# EAGLE schematic schematic (EAGLE 8.1.0)
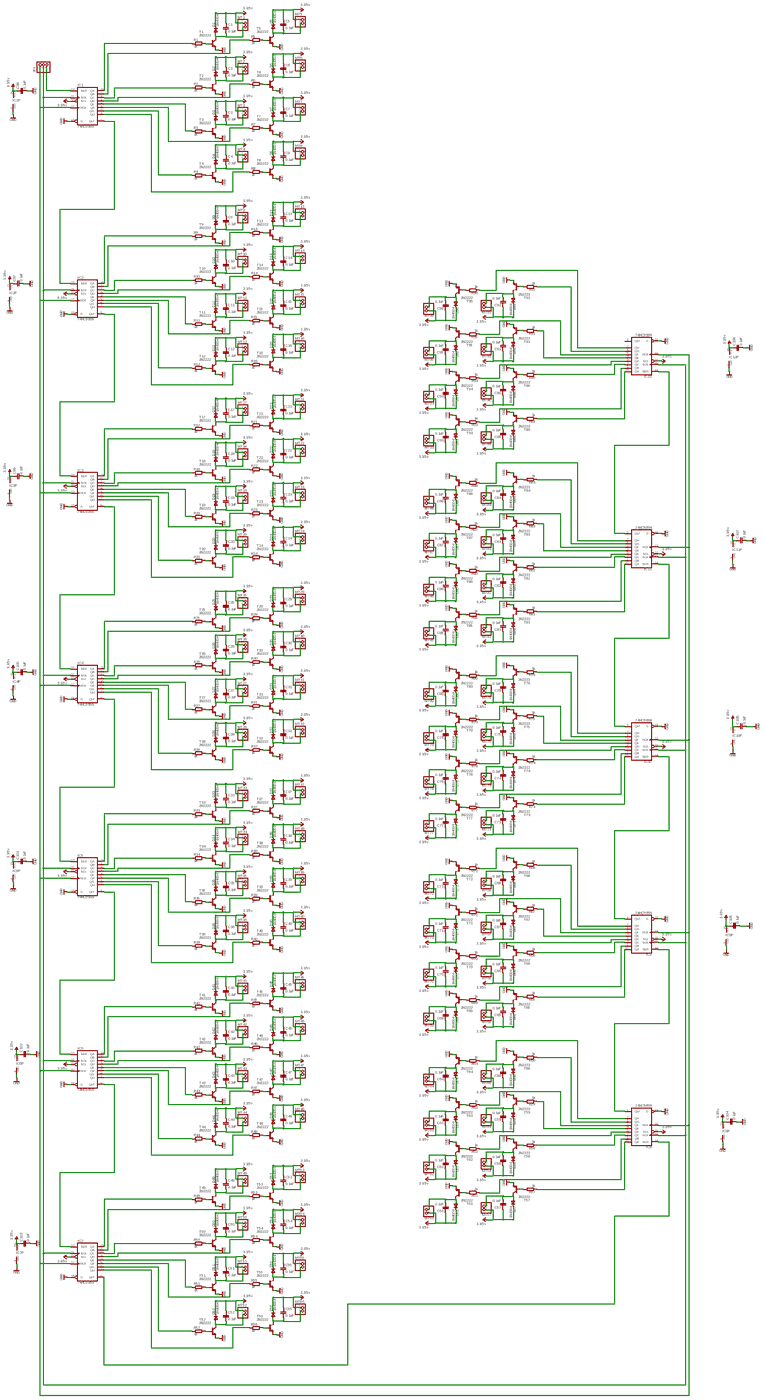
[diagram p0: schematic, sheet 1, overview]
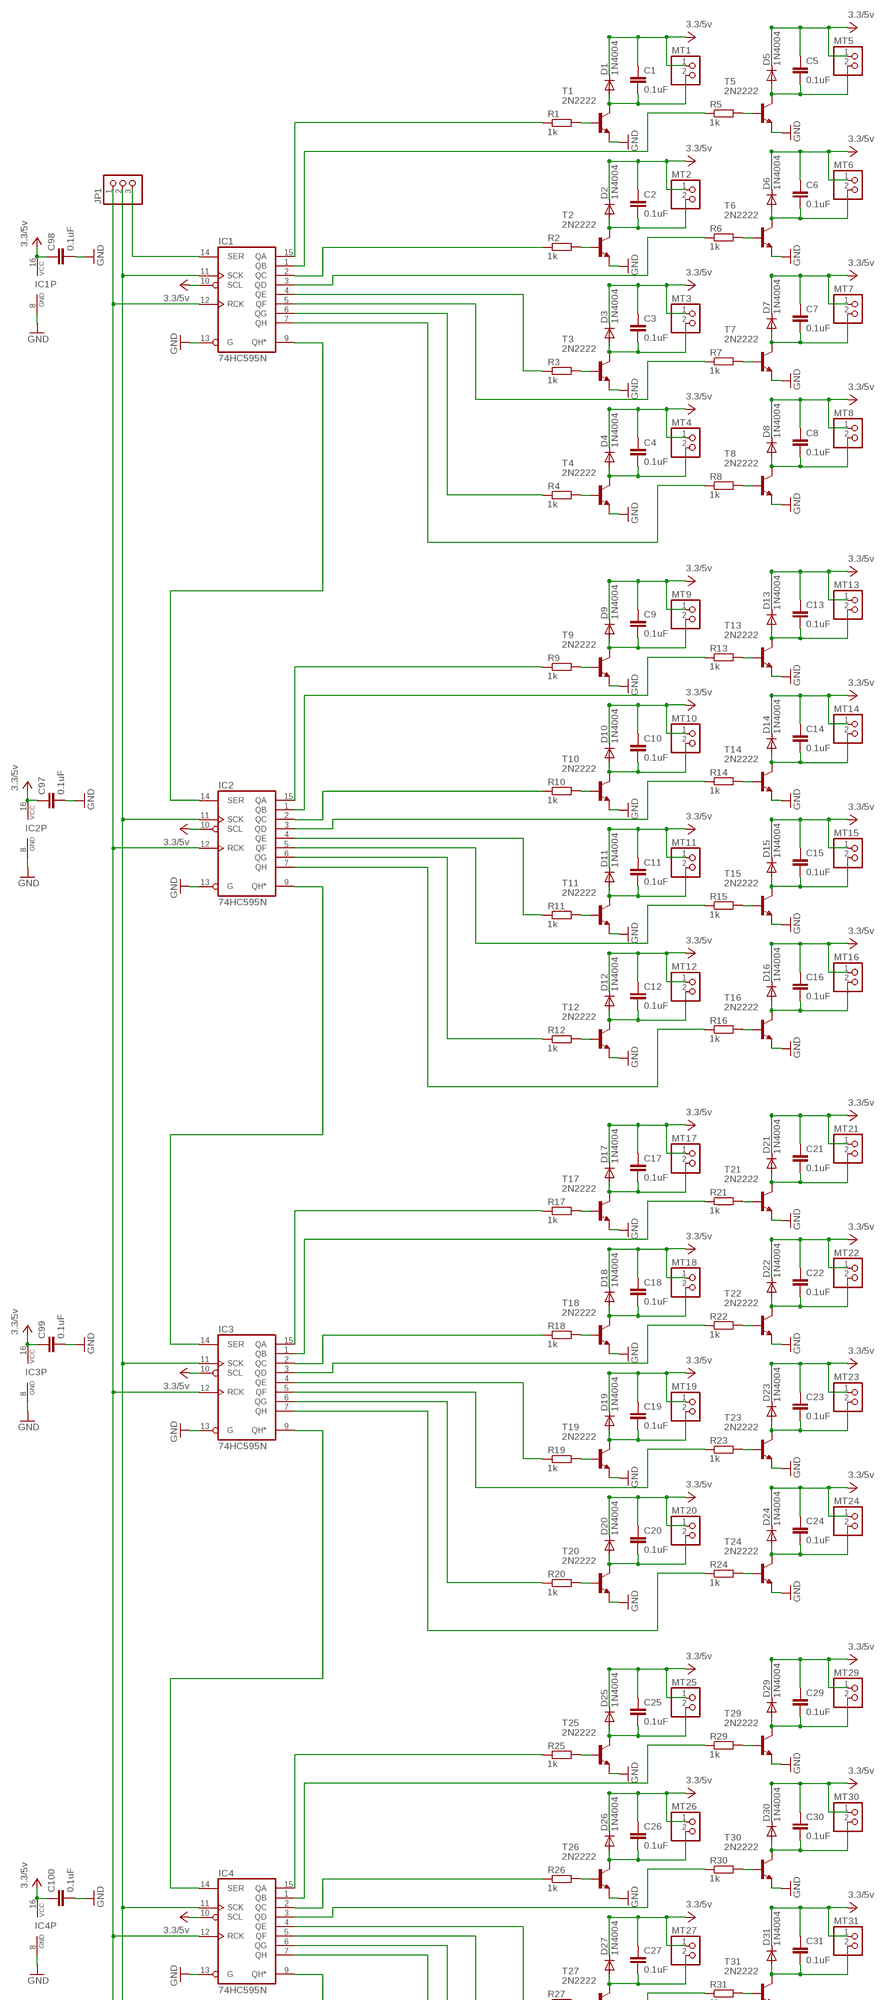
[diagram p1: schematic, sheet 1, part 1 of 4]
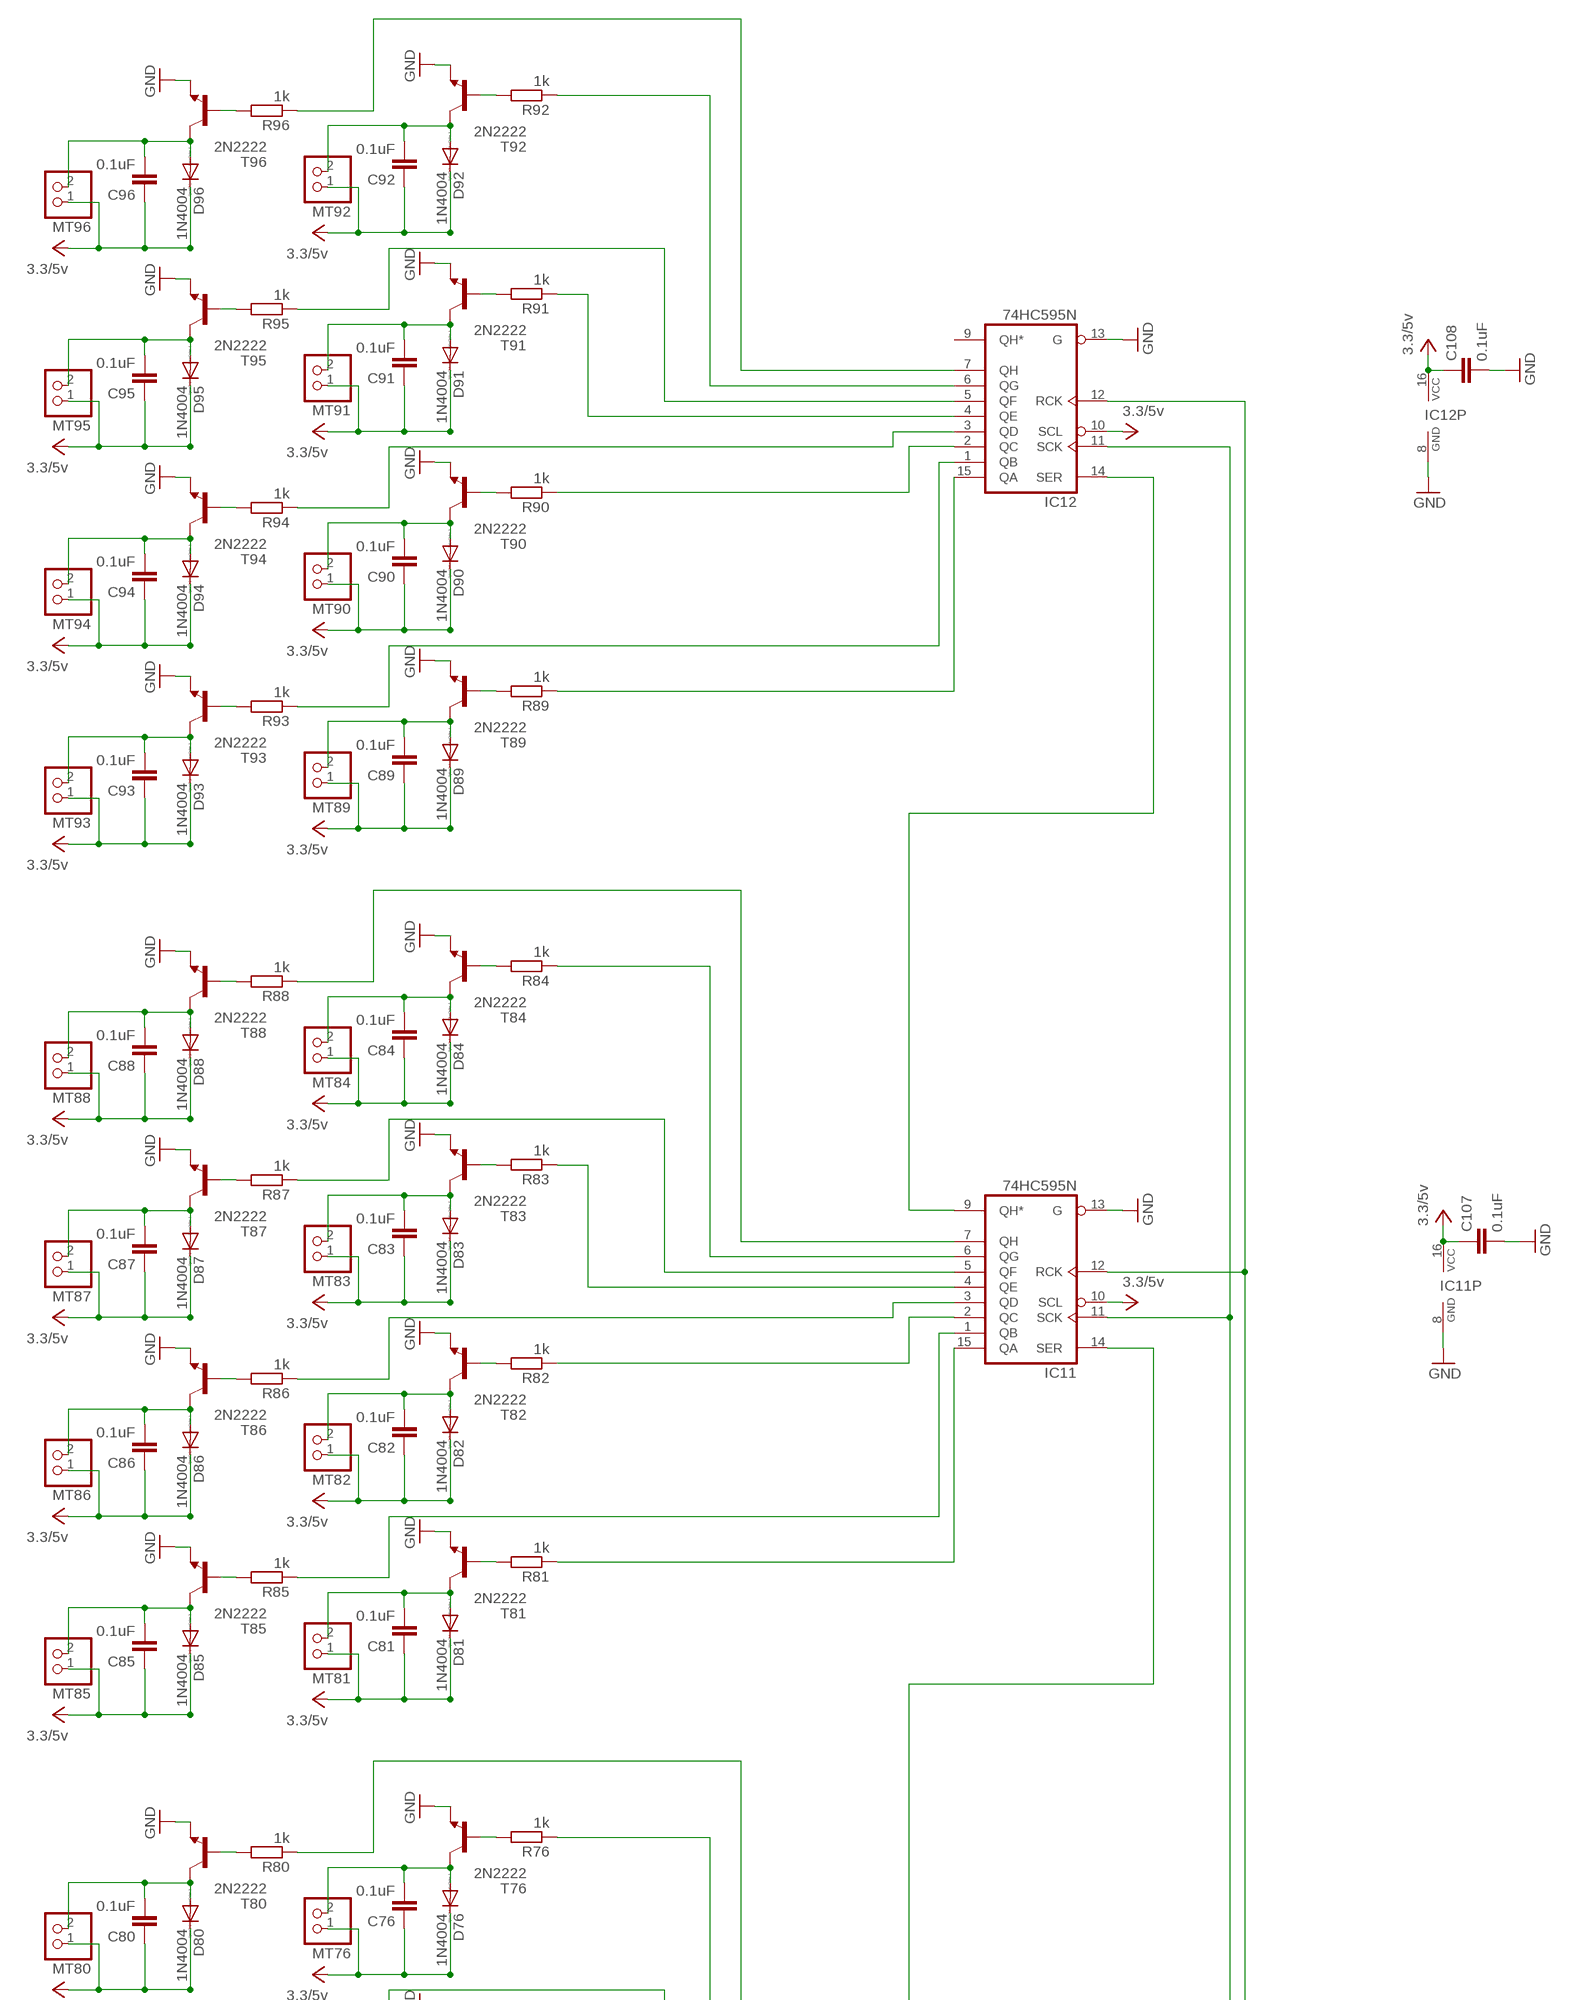
[diagram p2: schematic, sheet 1, part 2 of 4]
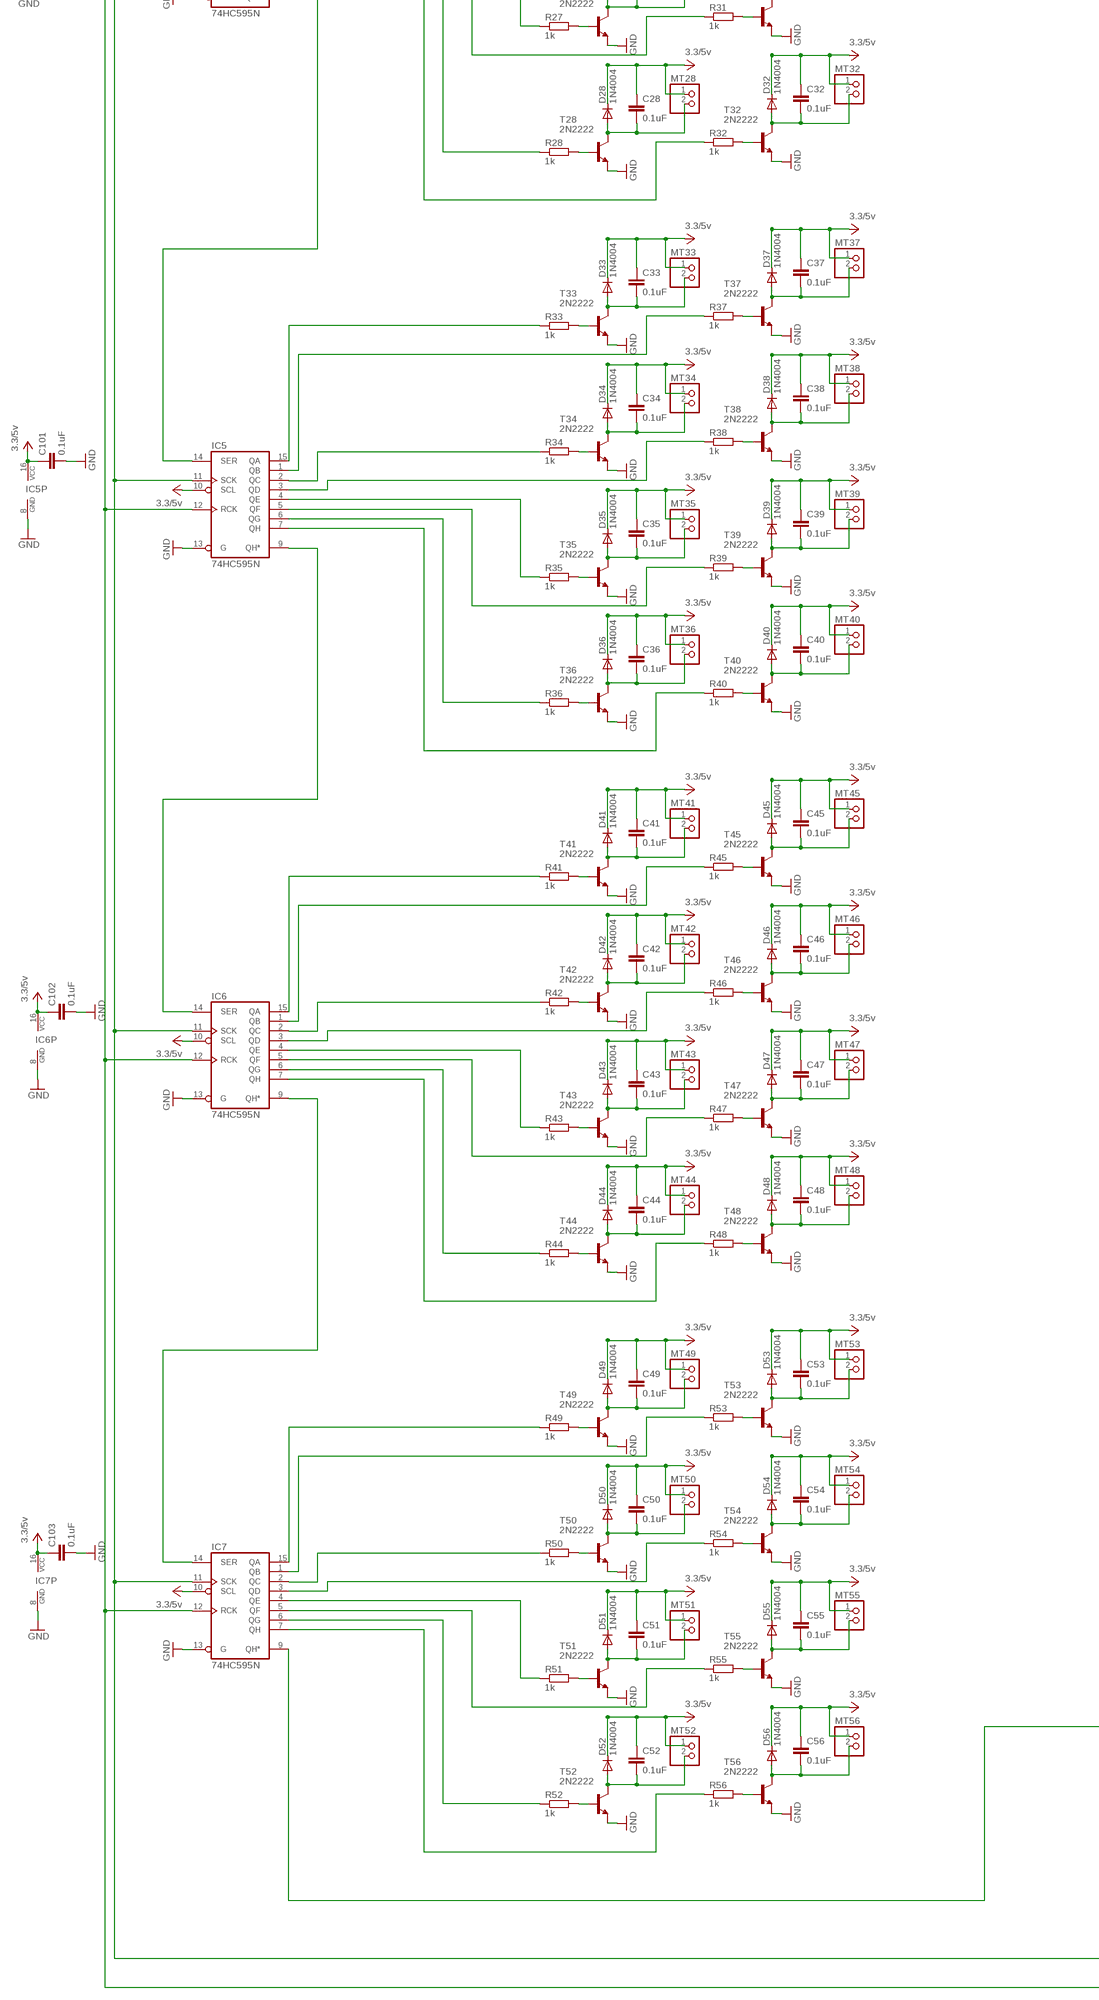
[diagram p3: schematic, sheet 1, part 3 of 4]
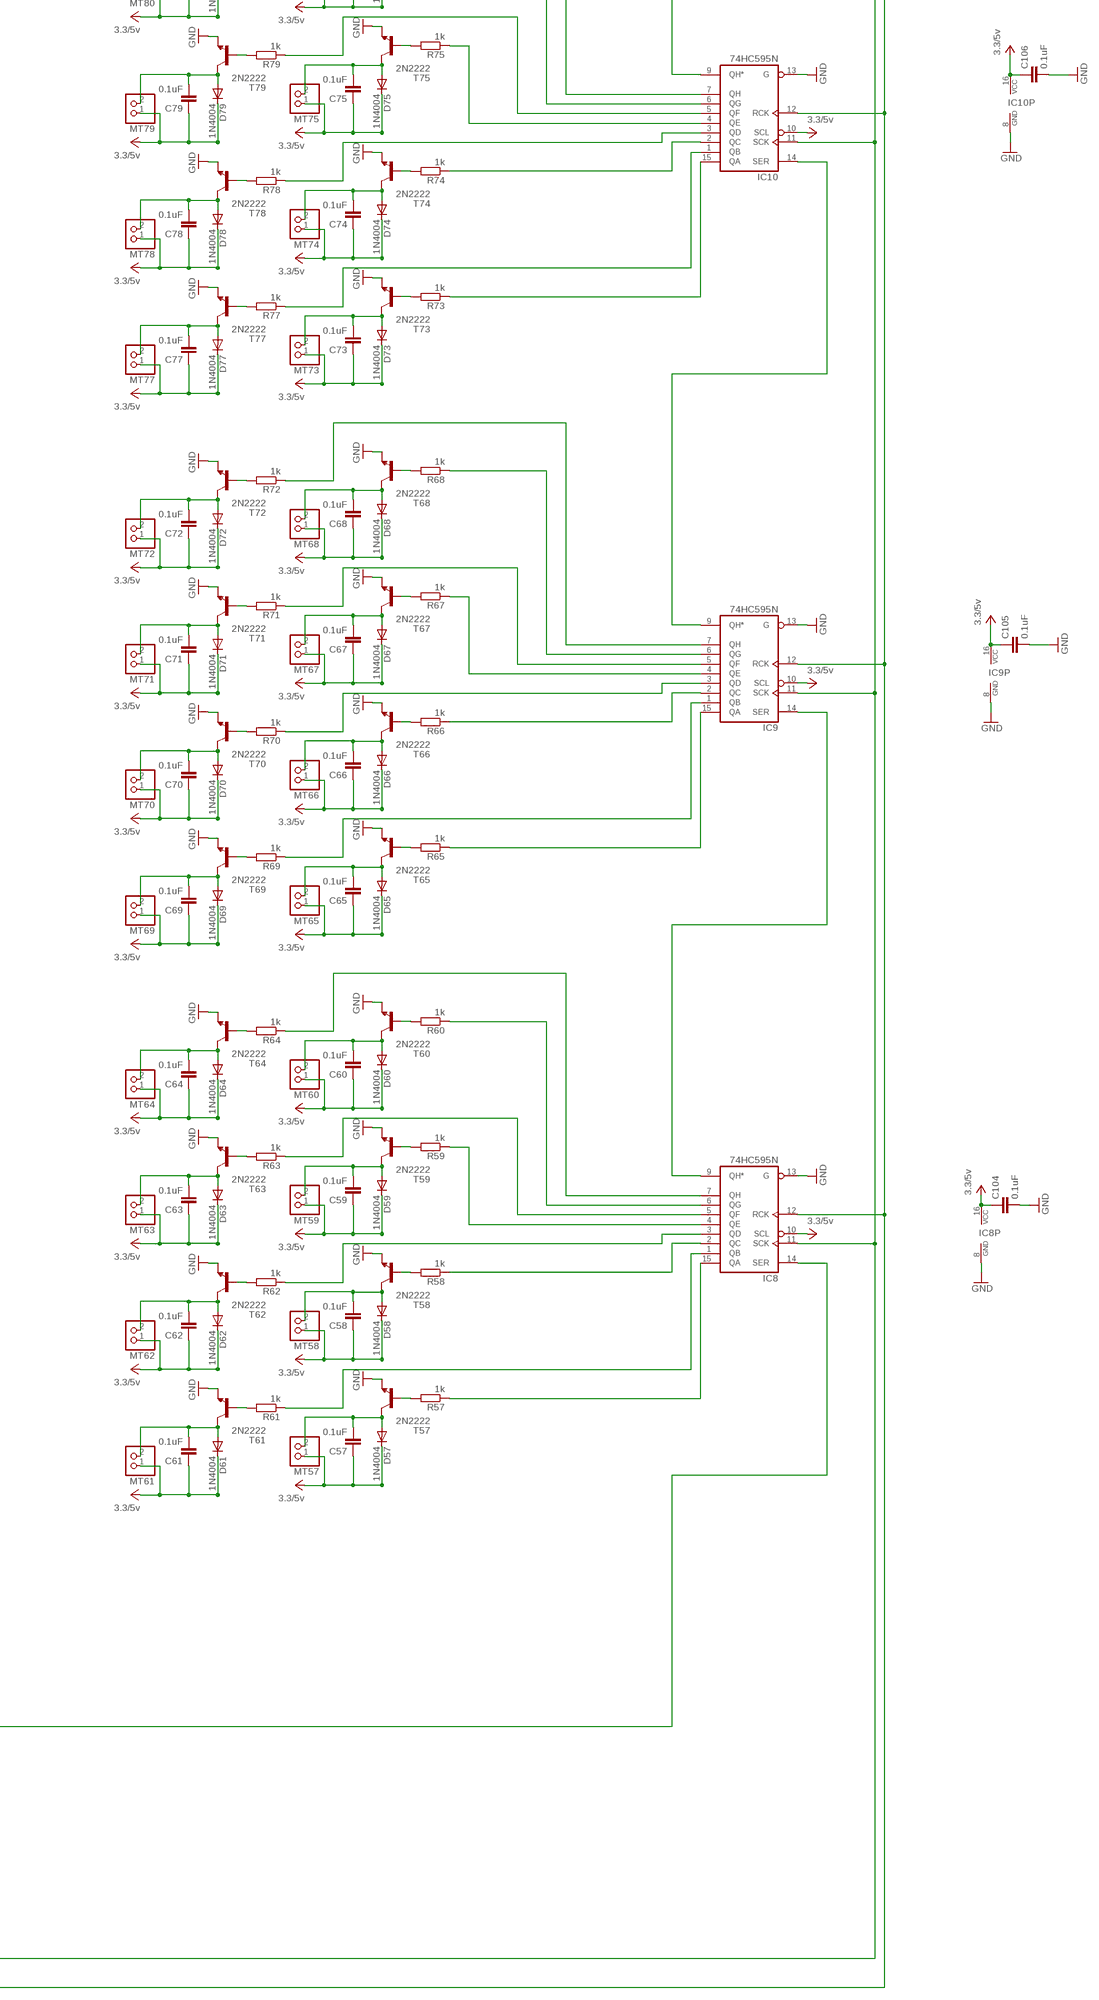
[diagram p4: schematic, sheet 1, part 4 of 4]

## Parts
C1  0.1uF  C-EU025-024X044  [C025-024X044]
C2  0.1uF  C-EU025-024X044  [C025-024X044]
C3  0.1uF  C-EU025-024X044  [C025-024X044]
C4  0.1uF  C-EU025-024X044  [C025-024X044]
C5  0.1uF  C-EU025-024X044  [C025-024X044]
C6  0.1uF  C-EU025-024X044  [C025-024X044]
C7  0.1uF  C-EU025-024X044  [C025-024X044]
C8  0.1uF  C-EU025-024X044  [C025-024X044]
C9  0.1uF  C-EU025-024X044  [C025-024X044]
C10  0.1uF  C-EU025-024X044  [C025-024X044]
C11  0.1uF  C-EU025-024X044  [C025-024X044]
C12  0.1uF  C-EU025-024X044  [C025-024X044]
C13  0.1uF  C-EU025-024X044  [C025-024X044]
C14  0.1uF  C-EU025-024X044  [C025-024X044]
C15  0.1uF  C-EU025-024X044  [C025-024X044]
C16  0.1uF  C-EU025-024X044  [C025-024X044]
C17  0.1uF  C-EU025-024X044  [C025-024X044]
C18  0.1uF  C-EU025-024X044  [C025-024X044]
C19  0.1uF  C-EU025-024X044  [C025-024X044]
C20  0.1uF  C-EU025-024X044  [C025-024X044]
C21  0.1uF  C-EU025-024X044  [C025-024X044]
C22  0.1uF  C-EU025-024X044  [C025-024X044]
C23  0.1uF  C-EU025-024X044  [C025-024X044]
C24  0.1uF  C-EU025-024X044  [C025-024X044]
C25  0.1uF  C-EU025-024X044  [C025-024X044]
C26  0.1uF  C-EU025-024X044  [C025-024X044]
C27  0.1uF  C-EU025-024X044  [C025-024X044]
C28  0.1uF  C-EU025-024X044  [C025-024X044]
C29  0.1uF  C-EU025-024X044  [C025-024X044]
C30  0.1uF  C-EU025-024X044  [C025-024X044]
C31  0.1uF  C-EU025-024X044  [C025-024X044]
C32  0.1uF  C-EU025-024X044  [C025-024X044]
C33  0.1uF  C-EU025-024X044  [C025-024X044]
C34  0.1uF  C-EU025-024X044  [C025-024X044]
C35  0.1uF  C-EU025-024X044  [C025-024X044]
C36  0.1uF  C-EU025-024X044  [C025-024X044]
C37  0.1uF  C-EU025-024X044  [C025-024X044]
C38  0.1uF  C-EU025-024X044  [C025-024X044]
C39  0.1uF  C-EU025-024X044  [C025-024X044]
C40  0.1uF  C-EU025-024X044  [C025-024X044]
C41  0.1uF  C-EU025-024X044  [C025-024X044]
C42  0.1uF  C-EU025-024X044  [C025-024X044]
C43  0.1uF  C-EU025-024X044  [C025-024X044]
C44  0.1uF  C-EU025-024X044  [C025-024X044]
C45  0.1uF  C-EU025-024X044  [C025-024X044]
C46  0.1uF  C-EU025-024X044  [C025-024X044]
C47  0.1uF  C-EU025-024X044  [C025-024X044]
C48  0.1uF  C-EU025-024X044  [C025-024X044]
C49  0.1uF  C-EU025-024X044  [C025-024X044]
C50  0.1uF  C-EU025-024X044  [C025-024X044]
C51  0.1uF  C-EU025-024X044  [C025-024X044]
C52  0.1uF  C-EU025-024X044  [C025-024X044]
C53  0.1uF  C-EU025-024X044  [C025-024X044]
C54  0.1uF  C-EU025-024X044  [C025-024X044]
C55  0.1uF  C-EU025-024X044  [C025-024X044]
C56  0.1uF  C-EU025-024X044  [C025-024X044]
C57  0.1uF  C-EU025-024X044  [C025-024X044]
C58  0.1uF  C-EU025-024X044  [C025-024X044]
C59  0.1uF  C-EU025-024X044  [C025-024X044]
C60  0.1uF  C-EU025-024X044  [C025-024X044]
C61  0.1uF  C-EU025-024X044  [C025-024X044]
C62  0.1uF  C-EU025-024X044  [C025-024X044]
C63  0.1uF  C-EU025-024X044  [C025-024X044]
C64  0.1uF  C-EU025-024X044  [C025-024X044]
C65  0.1uF  C-EU025-024X044  [C025-024X044]
C66  0.1uF  C-EU025-024X044  [C025-024X044]
C67  0.1uF  C-EU025-024X044  [C025-024X044]
C68  0.1uF  C-EU025-024X044  [C025-024X044]
C69  0.1uF  C-EU025-024X044  [C025-024X044]
C70  0.1uF  C-EU025-024X044  [C025-024X044]
C71  0.1uF  C-EU025-024X044  [C025-024X044]
C72  0.1uF  C-EU025-024X044  [C025-024X044]
C73  0.1uF  C-EU025-024X044  [C025-024X044]
C74  0.1uF  C-EU025-024X044  [C025-024X044]
C75  0.1uF  C-EU025-024X044  [C025-024X044]
C76  0.1uF  C-EU025-024X044  [C025-024X044]
C77  0.1uF  C-EU025-024X044  [C025-024X044]
C78  0.1uF  C-EU025-024X044  [C025-024X044]
C79  0.1uF  C-EU025-024X044  [C025-024X044]
C80  0.1uF  C-EU025-024X044  [C025-024X044]
C81  0.1uF  C-EU025-024X044  [C025-024X044]
C82  0.1uF  C-EU025-024X044  [C025-024X044]
C83  0.1uF  C-EU025-024X044  [C025-024X044]
C84  0.1uF  C-EU025-024X044  [C025-024X044]
C85  0.1uF  C-EU025-024X044  [C025-024X044]
C86  0.1uF  C-EU025-024X044  [C025-024X044]
C87  0.1uF  C-EU025-024X044  [C025-024X044]
C88  0.1uF  C-EU025-024X044  [C025-024X044]
C89  0.1uF  C-EU025-024X044  [C025-024X044]
C90  0.1uF  C-EU025-024X044  [C025-024X044]
C91  0.1uF  C-EU025-024X044  [C025-024X044]
C92  0.1uF  C-EU025-024X044  [C025-024X044]
C93  0.1uF  C-EU025-024X044  [C025-024X044]
C94  0.1uF  C-EU025-024X044  [C025-024X044]
C95  0.1uF  C-EU025-024X044  [C025-024X044]
C96  0.1uF  C-EU025-024X044  [C025-024X044]
C97  0.1uF  C-EU025-024X044  [C025-024X044]
C98  0.1uF  C-EU025-024X044  [C025-024X044]
C99  0.1uF  C-EU025-024X044  [C025-024X044]
C100  0.1uF  C-EU025-024X044  [C025-024X044]
C101  0.1uF  C-EU025-024X044  [C025-024X044]
C102  0.1uF  C-EU025-024X044  [C025-024X044]
C103  0.1uF  C-EU025-024X044  [C025-024X044]
C104  0.1uF  C-EU025-024X044  [C025-024X044]
C105  0.1uF  C-EU025-024X044  [C025-024X044]
C106  0.1uF  C-EU025-024X044  [C025-024X044]
C107  0.1uF  C-EU025-024X044  [C025-024X044]
C108  0.1uF  C-EU025-024X044  [C025-024X044]
D1  1N4004  [DO41-10]
D2  1N4004  [DO41-10]
D3  1N4004  [DO41-10]
D4  1N4004  [DO41-10]
D5  1N4004  [DO41-10]
D6  1N4004  [DO41-10]
D7  1N4004  [DO41-10]
D8  1N4004  [DO41-10]
D9  1N4004  [DO41-10]
D10  1N4004  [DO41-10]
D11  1N4004  [DO41-10]
D12  1N4004  [DO41-10]
D13  1N4004  [DO41-10]
D14  1N4004  [DO41-10]
D15  1N4004  [DO41-10]
D16  1N4004  [DO41-10]
D17  1N4004  [DO41-10]
D18  1N4004  [DO41-10]
D19  1N4004  [DO41-10]
D20  1N4004  [DO41-10]
D21  1N4004  [DO41-10]
D22  1N4004  [DO41-10]
D23  1N4004  [DO41-10]
D24  1N4004  [DO41-10]
D25  1N4004  [DO41-10]
D26  1N4004  [DO41-10]
D27  1N4004  [DO41-10]
D28  1N4004  [DO41-10]
D29  1N4004  [DO41-10]
D30  1N4004  [DO41-10]
D31  1N4004  [DO41-10]
D32  1N4004  [DO41-10]
D33  1N4004  [DO41-10]
D34  1N4004  [DO41-10]
D35  1N4004  [DO41-10]
D36  1N4004  [DO41-10]
D37  1N4004  [DO41-10]
D38  1N4004  [DO41-10]
D39  1N4004  [DO41-10]
D40  1N4004  [DO41-10]
D41  1N4004  [DO41-10]
D42  1N4004  [DO41-10]
D43  1N4004  [DO41-10]
D44  1N4004  [DO41-10]
D45  1N4004  [DO41-10]
D46  1N4004  [DO41-10]
D47  1N4004  [DO41-10]
D48  1N4004  [DO41-10]
D49  1N4004  [DO41-10]
D50  1N4004  [DO41-10]
D51  1N4004  [DO41-10]
D52  1N4004  [DO41-10]
D53  1N4004  [DO41-10]
D54  1N4004  [DO41-10]
D55  1N4004  [DO41-10]
D56  1N4004  [DO41-10]
D57  1N4004  [DO41-10]
D58  1N4004  [DO41-10]
D59  1N4004  [DO41-10]
D60  1N4004  [DO41-10]
D61  1N4004  [DO41-10]
D62  1N4004  [DO41-10]
D63  1N4004  [DO41-10]
D64  1N4004  [DO41-10]
D65  1N4004  [DO41-10]
D66  1N4004  [DO41-10]
D67  1N4004  [DO41-10]
D68  1N4004  [DO41-10]
D69  1N4004  [DO41-10]
D70  1N4004  [DO41-10]
D71  1N4004  [DO41-10]
D72  1N4004  [DO41-10]
D73  1N4004  [DO41-10]
D74  1N4004  [DO41-10]
D75  1N4004  [DO41-10]
D76  1N4004  [DO41-10]
D77  1N4004  [DO41-10]
D78  1N4004  [DO41-10]
D79  1N4004  [DO41-10]
D80  1N4004  [DO41-10]
D81  1N4004  [DO41-10]
D82  1N4004  [DO41-10]
D83  1N4004  [DO41-10]
D84  1N4004  [DO41-10]
D85  1N4004  [DO41-10]
D86  1N4004  [DO41-10]
D87  1N4004  [DO41-10]
D88  1N4004  [DO41-10]
D89  1N4004  [DO41-10]
D90  1N4004  [DO41-10]
D91  1N4004  [DO41-10]
D92  1N4004  [DO41-10]
D93  1N4004  [DO41-10]
D94  1N4004  [DO41-10]
D95  1N4004  [DO41-10]
D96  1N4004  [DO41-10]
IC1  74HC595N  [DIL16]
IC2  74HC595N  [DIL16]
IC3  74HC595N  [DIL16]
IC4  74HC595N  [DIL16]
IC5  74HC595N  [DIL16]
IC6  74HC595N  [DIL16]
IC7  74HC595N  [DIL16]
IC8  74HC595N  [DIL16]
IC9  74HC595N  [DIL16]
IC10  74HC595N  [DIL16]
IC11  74HC595N  [DIL16]
IC12  74HC595N  [DIL16]
JP1  PINHD-1X3  [1X03]
MT1  PINHD-1X2  [1X02]
MT2  PINHD-1X2  [1X02]
MT3  PINHD-1X2  [1X02]
MT4  PINHD-1X2  [1X02]
MT5  PINHD-1X2  [1X02]
MT6  PINHD-1X2  [1X02]
MT7  PINHD-1X2  [1X02]
MT8  PINHD-1X2  [1X02]
MT9  PINHD-1X2  [1X02]
MT10  PINHD-1X2  [1X02]
MT11  PINHD-1X2  [1X02]
MT12  PINHD-1X2  [1X02]
MT13  PINHD-1X2  [1X02]
MT14  PINHD-1X2  [1X02]
MT15  PINHD-1X2  [1X02]
MT16  PINHD-1X2  [1X02]
MT17  PINHD-1X2  [1X02]
MT18  PINHD-1X2  [1X02]
MT19  PINHD-1X2  [1X02]
MT20  PINHD-1X2  [1X02]
MT21  PINHD-1X2  [1X02]
MT22  PINHD-1X2  [1X02]
MT23  PINHD-1X2  [1X02]
MT24  PINHD-1X2  [1X02]
MT25  PINHD-1X2  [1X02]
MT26  PINHD-1X2  [1X02]
MT27  PINHD-1X2  [1X02]
MT28  PINHD-1X2  [1X02]
MT29  PINHD-1X2  [1X02]
MT30  PINHD-1X2  [1X02]
MT31  PINHD-1X2  [1X02]
MT32  PINHD-1X2  [1X02]
MT33  PINHD-1X2  [1X02]
MT34  PINHD-1X2  [1X02]
MT35  PINHD-1X2  [1X02]
MT36  PINHD-1X2  [1X02]
MT37  PINHD-1X2  [1X02]
MT38  PINHD-1X2  [1X02]
MT39  PINHD-1X2  [1X02]
MT40  PINHD-1X2  [1X02]
MT41  PINHD-1X2  [1X02]
MT42  PINHD-1X2  [1X02]
MT43  PINHD-1X2  [1X02]
MT44  PINHD-1X2  [1X02]
MT45  PINHD-1X2  [1X02]
MT46  PINHD-1X2  [1X02]
MT47  PINHD-1X2  [1X02]
MT48  PINHD-1X2  [1X02]
MT49  PINHD-1X2  [1X02]
MT50  PINHD-1X2  [1X02]
MT51  PINHD-1X2  [1X02]
MT52  PINHD-1X2  [1X02]
MT53  PINHD-1X2  [1X02]
MT54  PINHD-1X2  [1X02]
MT55  PINHD-1X2  [1X02]
MT56  PINHD-1X2  [1X02]
MT57  PINHD-1X2  [1X02]
MT58  PINHD-1X2  [1X02]
MT59  PINHD-1X2  [1X02]
MT60  PINHD-1X2  [1X02]
MT61  PINHD-1X2  [1X02]
MT62  PINHD-1X2  [1X02]
MT63  PINHD-1X2  [1X02]
MT64  PINHD-1X2  [1X02]
MT65  PINHD-1X2  [1X02]
MT66  PINHD-1X2  [1X02]
MT67  PINHD-1X2  [1X02]
MT68  PINHD-1X2  [1X02]
MT69  PINHD-1X2  [1X02]
MT70  PINHD-1X2  [1X02]
MT71  PINHD-1X2  [1X02]
MT72  PINHD-1X2  [1X02]
MT73  PINHD-1X2  [1X02]
MT74  PINHD-1X2  [1X02]
MT75  PINHD-1X2  [1X02]
MT76  PINHD-1X2  [1X02]
MT77  PINHD-1X2  [1X02]
MT78  PINHD-1X2  [1X02]
MT79  PINHD-1X2  [1X02]
MT80  PINHD-1X2  [1X02]
MT81  PINHD-1X2  [1X02]
MT82  PINHD-1X2  [1X02]
MT83  PINHD-1X2  [1X02]
MT84  PINHD-1X2  [1X02]
MT85  PINHD-1X2  [1X02]
MT86  PINHD-1X2  [1X02]
MT87  PINHD-1X2  [1X02]
MT88  PINHD-1X2  [1X02]
MT89  PINHD-1X2  [1X02]
MT90  PINHD-1X2  [1X02]
MT91  PINHD-1X2  [1X02]
MT92  PINHD-1X2  [1X02]
MT93  PINHD-1X2  [1X02]
MT94  PINHD-1X2  [1X02]
MT95  PINHD-1X2  [1X02]
MT96  PINHD-1X2  [1X02]
R1  1k  R-EU_0411/15  [0411/15]
R2  1k  R-EU_0411/15  [0411/15]
R3  1k  R-EU_0411/15  [0411/15]
R4  1k  R-EU_0411/15  [0411/15]
R5  1k  R-EU_0411/15  [0411/15]
R6  1k  R-EU_0411/15  [0411/15]
R7  1k  R-EU_0411/15  [0411/15]
R8  1k  R-EU_0411/15  [0411/15]
R9  1k  R-EU_0411/15  [0411/15]
R10  1k  R-EU_0411/15  [0411/15]
R11  1k  R-EU_0411/15  [0411/15]
R12  1k  R-EU_0411/15  [0411/15]
R13  1k  R-EU_0411/15  [0411/15]
R14  1k  R-EU_0411/15  [0411/15]
R15  1k  R-EU_0411/15  [0411/15]
R16  1k  R-EU_0411/15  [0411/15]
R17  1k  R-EU_0411/15  [0411/15]
R18  1k  R-EU_0411/15  [0411/15]
R19  1k  R-EU_0411/15  [0411/15]
R20  1k  R-EU_0411/15  [0411/15]
R21  1k  R-EU_0411/15  [0411/15]
R22  1k  R-EU_0411/15  [0411/15]
R23  1k  R-EU_0411/15  [0411/15]
R24  1k  R-EU_0411/15  [0411/15]
R25  1k  R-EU_0411/15  [0411/15]
R26  1k  R-EU_0411/15  [0411/15]
R27  1k  R-EU_0411/15  [0411/15]
R28  1k  R-EU_0411/15  [0411/15]
R29  1k  R-EU_0411/15  [0411/15]
R30  1k  R-EU_0411/15  [0411/15]
R31  1k  R-EU_0411/15  [0411/15]
R32  1k  R-EU_0411/15  [0411/15]
R33  1k  R-EU_0411/15  [0411/15]
R34  1k  R-EU_0411/15  [0411/15]
R35  1k  R-EU_0411/15  [0411/15]
R36  1k  R-EU_0411/15  [0411/15]
R37  1k  R-EU_0411/15  [0411/15]
R38  1k  R-EU_0411/15  [0411/15]
R39  1k  R-EU_0411/15  [0411/15]
R40  1k  R-EU_0411/15  [0411/15]
R41  1k  R-EU_0411/15  [0411/15]
R42  1k  R-EU_0411/15  [0411/15]
R43  1k  R-EU_0411/15  [0411/15]
R44  1k  R-EU_0411/15  [0411/15]
R45  1k  R-EU_0411/15  [0411/15]
R46  1k  R-EU_0411/15  [0411/15]
R47  1k  R-EU_0411/15  [0411/15]
R48  1k  R-EU_0411/15  [0411/15]
R49  1k  R-EU_0411/15  [0411/15]
R50  1k  R-EU_0411/15  [0411/15]
R51  1k  R-EU_0411/15  [0411/15]
R52  1k  R-EU_0411/15  [0411/15]
R53  1k  R-EU_0411/15  [0411/15]
R54  1k  R-EU_0411/15  [0411/15]
R55  1k  R-EU_0411/15  [0411/15]
R56  1k  R-EU_0411/15  [0411/15]
R57  1k  R-EU_0411/15  [0411/15]
R58  1k  R-EU_0411/15  [0411/15]
R59  1k  R-EU_0411/15  [0411/15]
R60  1k  R-EU_0411/15  [0411/15]
R61  1k  R-EU_0411/15  [0411/15]
R62  1k  R-EU_0411/15  [0411/15]
R63  1k  R-EU_0411/15  [0411/15]
R64  1k  R-EU_0411/15  [0411/15]
R65  1k  R-EU_0411/15  [0411/15]
R66  1k  R-EU_0411/15  [0411/15]
R67  1k  R-EU_0411/15  [0411/15]
R68  1k  R-EU_0411/15  [0411/15]
R69  1k  R-EU_0411/15  [0411/15]
R70  1k  R-EU_0411/15  [0411/15]
R71  1k  R-EU_0411/15  [0411/15]
R72  1k  R-EU_0411/15  [0411/15]
R73  1k  R-EU_0411/15  [0411/15]
R74  1k  R-EU_0411/15  [0411/15]
R75  1k  R-EU_0411/15  [0411/15]
R76  1k  R-EU_0411/15  [0411/15]
R77  1k  R-EU_0411/15  [0411/15]
R78  1k  R-EU_0411/15  [0411/15]
R79  1k  R-EU_0411/15  [0411/15]
R80  1k  R-EU_0411/15  [0411/15]
R81  1k  R-EU_0411/15  [0411/15]
R82  1k  R-EU_0411/15  [0411/15]
R83  1k  R-EU_0411/15  [0411/15]
R84  1k  R-EU_0411/15  [0411/15]
R85  1k  R-EU_0411/15  [0411/15]
R86  1k  R-EU_0411/15  [0411/15]
R87  1k  R-EU_0411/15  [0411/15]
R88  1k  R-EU_0411/15  [0411/15]
R89  1k  R-EU_0411/15  [0411/15]
R90  1k  R-EU_0411/15  [0411/15]
R91  1k  R-EU_0411/15  [0411/15]
R92  1k  R-EU_0411/15  [0411/15]
R93  1k  R-EU_0411/15  [0411/15]
R94  1k  R-EU_0411/15  [0411/15]
R95  1k  R-EU_0411/15  [0411/15]
R96  1k  R-EU_0411/15  [0411/15]
T1  2N2222  [TO18]
T2  2N2222  [TO18]
T3  2N2222  [TO18]
T4  2N2222  [TO18]
T5  2N2222  [TO18]
T6  2N2222  [TO18]
T7  2N2222  [TO18]
T8  2N2222  [TO18]
T9  2N2222  [TO18]
T10  2N2222  [TO18]
T11  2N2222  [TO18]
T12  2N2222  [TO18]
T13  2N2222  [TO18]
T14  2N2222  [TO18]
T15  2N2222  [TO18]
T16  2N2222  [TO18]
T17  2N2222  [TO18]
T18  2N2222  [TO18]
T19  2N2222  [TO18]
T20  2N2222  [TO18]
T21  2N2222  [TO18]
T22  2N2222  [TO18]
T23  2N2222  [TO18]
T24  2N2222  [TO18]
T25  2N2222  [TO18]
T26  2N2222  [TO18]
T27  2N2222  [TO18]
T28  2N2222  [TO18]
T29  2N2222  [TO18]
T30  2N2222  [TO18]
T31  2N2222  [TO18]
T32  2N2222  [TO18]
T33  2N2222  [TO18]
T34  2N2222  [TO18]
T35  2N2222  [TO18]
T36  2N2222  [TO18]
T37  2N2222  [TO18]
T38  2N2222  [TO18]
T39  2N2222  [TO18]
T40  2N2222  [TO18]
T41  2N2222  [TO18]
T42  2N2222  [TO18]
T43  2N2222  [TO18]
T44  2N2222  [TO18]
T45  2N2222  [TO18]
T46  2N2222  [TO18]
T47  2N2222  [TO18]
T48  2N2222  [TO18]
T49  2N2222  [TO18]
T50  2N2222  [TO18]
T51  2N2222  [TO18]
T52  2N2222  [TO18]
T53  2N2222  [TO18]
T54  2N2222  [TO18]
T55  2N2222  [TO18]
T56  2N2222  [TO18]
T57  2N2222  [TO18]
T58  2N2222  [TO18]
T59  2N2222  [TO18]
T60  2N2222  [TO18]
T61  2N2222  [TO18]
T62  2N2222  [TO18]
T63  2N2222  [TO18]
T64  2N2222  [TO18]
T65  2N2222  [TO18]
T66  2N2222  [TO18]
T67  2N2222  [TO18]
T68  2N2222  [TO18]
T69  2N2222  [TO18]
T70  2N2222  [TO18]
T71  2N2222  [TO18]
T72  2N2222  [TO18]
T73  2N2222  [TO18]
T74  2N2222  [TO18]
T75  2N2222  [TO18]
T76  2N2222  [TO18]
T77  2N2222  [TO18]
T78  2N2222  [TO18]
T79  2N2222  [TO18]
T80  2N2222  [TO18]
T81  2N2222  [TO18]
T82  2N2222  [TO18]
T83  2N2222  [TO18]
T84  2N2222  [TO18]
T85  2N2222  [TO18]
T86  2N2222  [TO18]
T87  2N2222  [TO18]
T88  2N2222  [TO18]
T89  2N2222  [TO18]
T90  2N2222  [TO18]
T91  2N2222  [TO18]
T92  2N2222  [TO18]
T93  2N2222  [TO18]
T94  2N2222  [TO18]
T95  2N2222  [TO18]
T96  2N2222  [TO18]

## Nets
GND: C97.2 C98.2 C99.2 C100.2 C101.2 C102.2 C103.2 C104.2 C105.2 C106.2 C107.2 C108.2 IC1.8(GND) IC1.13(G) IC2.8(GND) IC2.13(G) IC3.8(GND) IC3.13(G) IC4.8(GND) IC4.13(G) IC5.8(GND) IC5.13(G) IC6.8(GND) IC6.13(G) IC7.8(GND) IC7.13(G) IC8.8(GND) IC8.13(G) IC9.8(GND) IC9.13(G) IC10.8(GND) IC10.13(G) IC11.8(GND) IC11.13(G) IC12.8(GND) IC12.13(G) T1.1(E) T2.1(E) T3.1(E) T4.1(E) T5.1(E) T6.1(E) T7.1(E) T8.1(E) T9.1(E) T10.1(E) T11.1(E) T12.1(E) T13.1(E) T14.1(E) T15.1(E) T16.1(E) T17.1(E) T18.1(E) T19.1(E) T20.1(E) T21.1(E) T22.1(E) T23.1(E) T24.1(E) T25.1(E) T26.1(E) T27.1(E) T28.1(E) T29.1(E) T30.1(E) T31.1(E) T32.1(E) T33.1(E) T34.1(E) T35.1(E) T36.1(E) T37.1(E) T38.1(E) T39.1(E) T40.1(E) T41.1(E) T42.1(E) T43.1(E) T44.1(E) T45.1(E) T46.1(E) T47.1(E) T48.1(E) T49.1(E) T50.1(E) T51.1(E) T52.1(E) T53.1(E) T54.1(E) T55.1(E) T56.1(E) T57.1(E) T58.1(E) T59.1(E) T60.1(E) T61.1(E) T62.1(E) T63.1(E) T64.1(E) T65.1(E) T66.1(E) T67.1(E) T68.1(E) T69.1(E) T70.1(E) T71.1(E) T72.1(E) T73.1(E) T74.1(E) T75.1(E) T76.1(E) T77.1(E) T78.1(E) T79.1(E) T80.1(E) T81.1(E) T82.1(E) T83.1(E) T84.1(E) T85.1(E) T86.1(E) T87.1(E) T88.1(E) T89.1(E) T90.1(E) T91.1(E) T92.1(E) T93.1(E) T94.1(E) T95.1(E) T96.1(E)
N$1: C1.2 D1.A MT1.2 T1.3(C)
N$2: C4.2 D4.A MT4.2 T4.3(C)
N$3: R4.2 T4.2(B)
N$4: R1.2 T1.2(B)
N$5: IC1.15(QA) R1.1
N$6: C2.2 D2.A MT2.2 T2.3(C)
N$7: R2.2 T2.2(B)
N$8: IC1.1(QB) R5.1
N$9: IC1.2(QC) R2.1
N$10: C3.2 D3.A MT3.2 T3.3(C)
N$11: R3.2 T3.2(B)
N$12: IC1.3(QD) R6.1
N$13: C5.2 D5.A MT5.2 T5.3(C)
N$14: R5.2 T5.2(B)
N$15: IC1.4(QE) R3.1
N$16: C6.2 D6.A MT6.2 T6.3(C)
N$17: R6.2 T6.2(B)
N$18: IC1.5(QF) R7.1
N$19: C7.2 D7.A MT7.2 T7.3(C)
N$20: R7.2 T7.2(B)
N$21: IC1.6(QG) R4.1
N$22: C8.2 D8.A MT8.2 T8.3(C)
N$23: R8.2 T8.2(B)
N$24: IC1.7(QH) R8.1
N$25: IC1.14(SER) JP1.3
N$29: C9.2 D9.A MT9.2 T9.3(C)
N$30: R9.2 T9.2(B)
N$31: C10.2 D10.A MT10.2 T10.3(C)
N$32: R10.2 T10.2(B)
N$33: C11.2 D11.A MT11.2 T11.3(C)
N$34: R11.2 T11.2(B)
N$35: C12.2 D12.A MT12.2 T12.3(C)
N$36: R12.2 T12.2(B)
N$37: C13.2 D13.A MT13.2 T13.3(C)
N$38: R13.2 T13.2(B)
N$39: C14.2 D14.A MT14.2 T14.3(C)
N$40: R14.2 T14.2(B)
N$41: C15.2 D15.A MT15.2 T15.3(C)
N$42: R15.2 T15.2(B)
N$43: C16.2 D16.A MT16.2 T16.3(C)
N$44: R16.2 T16.2(B)
N$45: IC2.15(QA) R9.1
N$46: IC2.1(QB) R13.1
N$47: IC2.2(QC) R10.1
N$48: IC2.3(QD) R14.1
N$49: IC2.4(QE) R11.1
N$50: IC2.5(QF) R15.1
N$51: IC2.6(QG) R12.1
N$52: IC2.7(QH) R16.1
N$54: C17.2 D17.A MT17.2 T17.3(C)
N$55: R17.2 T17.2(B)
N$56: IC1.9(QH*) IC2.14(SER)
N$57: C18.2 D18.A MT18.2 T18.3(C)
N$58: R18.2 T18.2(B)
N$59: C19.2 D19.A MT19.2 T19.3(C)
N$60: R19.2 T19.2(B)
N$61: C20.2 D20.A MT20.2 T20.3(C)
N$62: R20.2 T20.2(B)
N$63: C21.2 D21.A MT21.2 T21.3(C)
N$64: R21.2 T21.2(B)
N$65: C22.2 D22.A MT22.2 T22.3(C)
N$66: R22.2 T22.2(B)
N$67: C23.2 D23.A MT23.2 T23.3(C)
N$68: R23.2 T23.2(B)
N$69: C24.2 D24.A MT24.2 T24.3(C)
N$70: R24.2 T24.2(B)
N$71: IC3.15(QA) R17.1
N$72: IC3.1(QB) R21.1
N$73: IC3.2(QC) R18.1
N$74: IC3.3(QD) R22.1
N$75: IC3.4(QE) R19.1
N$76: IC3.5(QF) R23.1
N$77: IC3.6(QG) R20.1
N$78: IC3.7(QH) R24.1
N$79: IC2.9(QH*) IC3.14(SER)
N$80: C41.2 D41.A MT41.2 T41.3(C)
N$81: R41.2 T41.2(B)
N$82: C25.2 D25.A MT25.2 T25.3(C)
N$83: R25.2 T25.2(B)
N$84: C26.2 D26.A MT26.2 T26.3(C)
N$85: R26.2 T26.2(B)
N$86: C27.2 D27.A MT27.2 T27.3(C)
N$87: R27.2 T27.2(B)
N$88: C28.2 D28.A MT28.2 T28.3(C)
N$89: R28.2 T28.2(B)
N$90: C29.2 D29.A MT29.2 T29.3(C)
N$91: R29.2 T29.2(B)
N$92: C30.2 D30.A MT30.2 T30.3(C)
N$93: R30.2 T30.2(B)
N$94: C31.2 D31.A MT31.2 T31.3(C)
N$95: R31.2 T31.2(B)
N$96: C32.2 D32.A MT32.2 T32.3(C)
N$97: R32.2 T32.2(B)
N$98: IC4.15(QA) R25.1
N$99: IC4.1(QB) R29.1
N$100: IC4.2(QC) R26.1
N$101: IC4.3(QD) R30.1
N$102: IC4.4(QE) R27.1
N$103: IC4.5(QF) R31.1
N$104: IC4.6(QG) R28.1
N$105: IC4.7(QH) R32.1
N$106: IC3.9(QH*) IC4.14(SER)
N$107: C33.2 D33.A MT33.2 T33.3(C)
N$108: R33.2 T33.2(B)
N$109: C34.2 D34.A MT34.2 T34.3(C)
N$110: R34.2 T34.2(B)
N$111: C35.2 D35.A MT35.2 T35.3(C)
N$112: R35.2 T35.2(B)
N$113: C36.2 D36.A MT36.2 T36.3(C)
N$114: R36.2 T36.2(B)
N$115: C37.2 D37.A MT37.2 T37.3(C)
N$116: R37.2 T37.2(B)
N$117: C38.2 D38.A MT38.2 T38.3(C)
N$118: R38.2 T38.2(B)
N$119: C39.2 D39.A MT39.2 T39.3(C)
N$120: R39.2 T39.2(B)
N$121: C40.2 D40.A MT40.2 T40.3(C)
N$122: R40.2 T40.2(B)
N$123: IC5.15(QA) R33.1
N$124: IC5.1(QB) R37.1
N$125: IC5.2(QC) R34.1
N$126: IC5.3(QD) R38.1
N$127: IC5.4(QE) R35.1
N$128: IC5.5(QF) R39.1
N$129: IC5.6(QG) R36.1
N$130: IC5.7(QH) R40.1
N$131: IC4.9(QH*) IC5.14(SER)
N$132: C42.2 D42.A MT42.2 T42.3(C)
N$133: R42.2 T42.2(B)
N$134: C43.2 D43.A MT43.2 T43.3(C)
N$135: R43.2 T43.2(B)
N$136: C44.2 D44.A MT44.2 T44.3(C)
N$137: R44.2 T44.2(B)
N$138: C45.2 D45.A MT45.2 T45.3(C)
N$139: R45.2 T45.2(B)
N$140: C46.2 D46.A MT46.2 T46.3(C)
N$141: R46.2 T46.2(B)
N$142: C47.2 D47.A MT47.2 T47.3(C)
N$143: R47.2 T47.2(B)
N$144: C48.2 D48.A MT48.2 T48.3(C)
N$145: R48.2 T48.2(B)
N$146: IC6.15(QA) R41.1
N$147: IC6.1(QB) R45.1
N$148: IC6.2(QC) R42.1
N$149: IC6.3(QD) R46.1
N$150: IC6.4(QE) R43.1
N$151: IC6.5(QF) R47.1
N$152: IC6.6(QG) R44.1
N$153: IC6.7(QH) R48.1
N$154: IC5.9(QH*) IC6.14(SER)
N$155: C49.2 D49.A MT49.2 T49.3(C)
N$156: R49.2 T49.2(B)
N$157: C50.2 D50.A MT50.2 T50.3(C)
N$158: R50.2 T50.2(B)
N$159: C51.2 D51.A MT51.2 T51.3(C)
N$160: R51.2 T51.2(B)
N$161: C52.2 D52.A MT52.2 T52.3(C)
N$162: R52.2 T52.2(B)
N$163: C53.2 D53.A MT53.2 T53.3(C)
N$164: R53.2 T53.2(B)
N$165: C54.2 D54.A MT54.2 T54.3(C)
N$166: R54.2 T54.2(B)
N$167: C55.2 D55.A MT55.2 T55.3(C)
N$168: R55.2 T55.2(B)
N$169: C56.2 D56.A MT56.2 T56.3(C)
N$170: R56.2 T56.2(B)
N$171: IC7.15(QA) R49.1
N$172: IC7.1(QB) R53.1
N$173: IC7.2(QC) R50.1
N$174: IC7.3(QD) R54.1
N$175: IC7.4(QE) R51.1
N$176: IC7.5(QF) R55.1
N$177: IC7.6(QG) R52.1
N$178: IC7.7(QH) R56.1
N$179: IC6.9(QH*) IC7.14(SER)
N$180: IC1.11(SCK) IC2.11(SCK) IC3.11(SCK) IC4.11(SCK) IC5.11(SCK) IC6.11(SCK) IC7.11(SCK) IC8.11(SCK) IC9.11(SCK) IC10.11(SCK) IC11.11(SCK) IC12.11(SCK) JP1.2
N$181: IC1.12(RCK) IC2.12(RCK) IC3.12(RCK) IC4.12(RCK) IC5.12(RCK) IC6.12(RCK) IC7.12(RCK) IC8.12(RCK) IC9.12(RCK) IC10.12(RCK) IC11.12(RCK) IC12.12(RCK) JP1.1
N$182: C57.2 D57.A MT57.2 T57.3(C)
N$183: R57.2 T57.2(B)
N$184: C58.2 D58.A MT58.2 T58.3(C)
N$185: R58.2 T58.2(B)
N$186: C59.2 D59.A MT59.2 T59.3(C)
N$187: R59.2 T59.2(B)
N$188: C60.2 D60.A MT60.2 T60.3(C)
N$189: R60.2 T60.2(B)
N$190: C61.2 D61.A MT61.2 T61.3(C)
N$191: R61.2 T61.2(B)
N$192: C62.2 D62.A MT62.2 T62.3(C)
N$193: R62.2 T62.2(B)
N$194: C63.2 D63.A MT63.2 T63.3(C)
N$195: R63.2 T63.2(B)
N$196: C64.2 D64.A MT64.2 T64.3(C)
N$197: R64.2 T64.2(B)
N$198: IC8.15(QA) R57.1
N$199: IC8.1(QB) R61.1
N$200: IC8.2(QC) R58.1
N$201: IC8.3(QD) R62.1
N$202: IC8.4(QE) R59.1
N$203: IC8.5(QF) R63.1
N$204: IC8.6(QG) R60.1
N$205: IC8.7(QH) R64.1
N$206: IC7.9(QH*) IC8.14(SER)
N$207: C65.2 D65.A MT65.2 T65.3(C)
N$208: R65.2 T65.2(B)
N$209: C66.2 D66.A MT66.2 T66.3(C)
N$210: R66.2 T66.2(B)
N$211: C67.2 D67.A MT67.2 T67.3(C)
N$212: R67.2 T67.2(B)
N$213: C68.2 D68.A MT68.2 T68.3(C)
N$214: R68.2 T68.2(B)
N$215: C69.2 D69.A MT69.2 T69.3(C)
N$216: R69.2 T69.2(B)
N$217: C70.2 D70.A MT70.2 T70.3(C)
N$218: R70.2 T70.2(B)
N$219: C71.2 D71.A MT71.2 T71.3(C)
N$220: R71.2 T71.2(B)
N$221: C72.2 D72.A MT72.2 T72.3(C)
N$222: R72.2 T72.2(B)
N$223: IC9.15(QA) R65.1
N$224: IC9.1(QB) R69.1
N$225: IC9.2(QC) R66.1
N$226: IC9.3(QD) R70.1
N$227: IC9.4(QE) R67.1
N$228: IC9.5(QF) R71.1
N$229: IC9.6(QG) R68.1
N$230: IC9.7(QH) R72.1
N$231: IC8.9(QH*) IC9.14(SER)
N$232: C73.2 D73.A MT73.2 T73.3(C)
N$233: R73.2 T73.2(B)
N$234: C74.2 D74.A MT74.2 T74.3(C)
N$235: R74.2 T74.2(B)
N$236: C75.2 D75.A MT75.2 T75.3(C)
N$237: R75.2 T75.2(B)
N$238: C76.2 D76.A MT76.2 T76.3(C)
N$239: R76.2 T76.2(B)
N$240: C77.2 D77.A MT77.2 T77.3(C)
N$241: R77.2 T77.2(B)
N$242: C78.2 D78.A MT78.2 T78.3(C)
N$243: R78.2 T78.2(B)
N$244: C79.2 D79.A MT79.2 T79.3(C)
N$245: R79.2 T79.2(B)
N$246: C80.2 D80.A MT80.2 T80.3(C)
N$247: R80.2 T80.2(B)
N$248: IC10.15(QA) R73.1
N$249: IC10.1(QB) R77.1
N$250: IC10.2(QC) R74.1
N$251: IC10.3(QD) R78.1
N$252: IC10.4(QE) R75.1
N$253: IC10.5(QF) R79.1
N$254: IC10.6(QG) R76.1
N$255: IC10.7(QH) R80.1
N$256: IC9.9(QH*) IC10.14(SER)
N$257: C81.2 D81.A MT81.2 T81.3(C)
N$258: R81.2 T81.2(B)
N$259: C82.2 D82.A MT82.2 T82.3(C)
N$260: R82.2 T82.2(B)
N$261: C83.2 D83.A MT83.2 T83.3(C)
N$262: R83.2 T83.2(B)
N$263: C84.2 D84.A MT84.2 T84.3(C)
N$264: R84.2 T84.2(B)
N$265: C85.2 D85.A MT85.2 T85.3(C)
N$266: R85.2 T85.2(B)
N$267: C86.2 D86.A MT86.2 T86.3(C)
N$268: R86.2 T86.2(B)
N$269: C87.2 D87.A MT87.2 T87.3(C)
N$270: R87.2 T87.2(B)
N$271: C88.2 D88.A MT88.2 T88.3(C)
N$272: R88.2 T88.2(B)
N$273: IC11.15(QA) R81.1
N$274: IC11.1(QB) R85.1
N$275: IC11.2(QC) R82.1
N$276: IC11.3(QD) R86.1
N$277: IC11.4(QE) R83.1
N$278: IC11.5(QF) R87.1
N$279: IC11.6(QG) R84.1
N$280: IC11.7(QH) R88.1
N$281: IC10.9(QH*) IC11.14(SER)
N$282: C89.2 D89.A MT89.2 T89.3(C)
N$283: R89.2 T89.2(B)
N$284: C90.2 D90.A MT90.2 T90.3(C)
N$285: R90.2 T90.2(B)
N$286: C91.2 D91.A MT91.2 T91.3(C)
N$287: R91.2 T91.2(B)
N$288: C92.2 D92.A MT92.2 T92.3(C)
N$289: R92.2 T92.2(B)
N$290: C93.2 D93.A MT93.2 T93.3(C)
N$291: R93.2 T93.2(B)
N$292: C94.2 D94.A MT94.2 T94.3(C)
N$293: R94.2 T94.2(B)
N$294: C95.2 D95.A MT95.2 T95.3(C)
N$295: R95.2 T95.2(B)
N$296: C96.2 D96.A MT96.2 T96.3(C)
N$297: R96.2 T96.2(B)
N$298: IC12.15(QA) R89.1
N$299: IC12.1(QB) R93.1
N$300: IC12.2(QC) R90.1
N$301: IC12.3(QD) R94.1
N$302: IC12.4(QE) R91.1
N$303: IC12.5(QF) R95.1
N$304: IC12.6(QG) R92.1
N$305: IC12.7(QH) R96.1
N$306: IC11.9(QH*) IC12.14(SER)
VCC: C1.1 C2.1 C3.1 C4.1 C5.1 C6.1 C7.1 C8.1 C9.1 C10.1 C11.1 C12.1 C13.1 C14.1 C15.1 C16.1 C17.1 C18.1 C19.1 C20.1 C21.1 C22.1 C23.1 C24.1 C25.1 C26.1 C27.1 C28.1 C29.1 C30.1 C31.1 C32.1 C33.1 C34.1 C35.1 C36.1 C37.1 C38.1 C39.1 C40.1 C41.1 C42.1 C43.1 C44.1 C45.1 C46.1 C47.1 C48.1 C49.1 C50.1 C51.1 C52.1 C53.1 C54.1 C55.1 C56.1 C57.1 C58.1 C59.1 C60.1 C61.1 C62.1 C63.1 C64.1 C65.1 C66.1 C67.1 C68.1 C69.1 C70.1 C71.1 C72.1 C73.1 C74.1 C75.1 C76.1 C77.1 C78.1 C79.1 C80.1 C81.1 C82.1 C83.1 C84.1 C85.1 C86.1 C87.1 C88.1 C89.1 C90.1 C91.1 C92.1 C93.1 C94.1 C95.1 C96.1 C97.1 C98.1 C99.1 C100.1 C101.1 C102.1 C103.1 C104.1 C105.1 C106.1 C107.1 C108.1 D1.C D2.C D3.C D4.C D5.C D6.C D7.C D8.C D9.C D10.C D11.C D12.C D13.C D14.C D15.C D16.C D17.C D18.C D19.C D20.C D21.C D22.C D23.C D24.C D25.C D26.C D27.C D28.C D29.C D30.C D31.C D32.C D33.C D34.C D35.C D36.C D37.C D38.C D39.C D40.C D41.C D42.C D43.C D44.C D45.C D46.C D47.C D48.C D49.C D50.C D51.C D52.C D53.C D54.C D55.C D56.C D57.C D58.C D59.C D60.C D61.C D62.C D63.C D64.C D65.C D66.C D67.C D68.C D69.C D70.C D71.C D72.C D73.C D74.C D75.C D76.C D77.C D78.C D79.C D80.C D81.C D82.C D83.C D84.C D85.C D86.C D87.C D88.C D89.C D90.C D91.C D92.C D93.C D94.C D95.C D96.C IC1.10(SCL) IC1.16(VCC) IC2.10(SCL) IC2.16(VCC) IC3.10(SCL) IC3.16(VCC) IC4.10(SCL) IC4.16(VCC) IC5.10(SCL) IC5.16(VCC) IC6.10(SCL) IC6.16(VCC) IC7.10(SCL) IC7.16(VCC) IC8.10(SCL) IC8.16(VCC) IC9.10(SCL) IC9.16(VCC) IC10.10(SCL) IC10.16(VCC) IC11.10(SCL) IC11.16(VCC) IC12.10(SCL) IC12.16(VCC) MT1.1 MT2.1 MT3.1 MT4.1 MT5.1 MT6.1 MT7.1 MT8.1 MT9.1 MT10.1 MT11.1 MT12.1 MT13.1 MT14.1 MT15.1 MT16.1 MT17.1 MT18.1 MT19.1 MT20.1 MT21.1 MT22.1 MT23.1 MT24.1 MT25.1 MT26.1 MT27.1 MT28.1 MT29.1 MT30.1 MT31.1 MT32.1 MT33.1 MT34.1 MT35.1 MT36.1 MT37.1 MT38.1 MT39.1 MT40.1 MT41.1 MT42.1 MT43.1 MT44.1 MT45.1 MT46.1 MT47.1 MT48.1 MT49.1 MT50.1 MT51.1 MT52.1 MT53.1 MT54.1 MT55.1 MT56.1 MT57.1 MT58.1 MT59.1 MT60.1 MT61.1 MT62.1 MT63.1 MT64.1 MT65.1 MT66.1 MT67.1 MT68.1 MT69.1 MT70.1 MT71.1 MT72.1 MT73.1 MT74.1 MT75.1 MT76.1 MT77.1 MT78.1 MT79.1 MT80.1 MT81.1 MT82.1 MT83.1 MT84.1 MT85.1 MT86.1 MT87.1 MT88.1 MT89.1 MT90.1 MT91.1 MT92.1 MT93.1 MT94.1 MT95.1 MT96.1 ; supply symbol labelled 3.3/5v
Unconnected: IC12.9(QH*)

## Library data of the parts
C1-C108 = resistor:C-EU: CAPACITOR, European symbol
D1-D96 = diode:1N4004: DIODE general purpose rectifier, 1 A
IC1-IC12 = 74xx-eu:74*595: 8-bit SHIFT REGISTER, output latch
JP1 = pinhead:PINHD-1X3: PIN HEADER
MT1-MT96 = pinhead:PINHD-1X2: PIN HEADER
R1-R96 = rcl:R-EU_: RESISTOR, European symbol
T1-T96 = transistor:2N2222: NPN TRANSISTOR